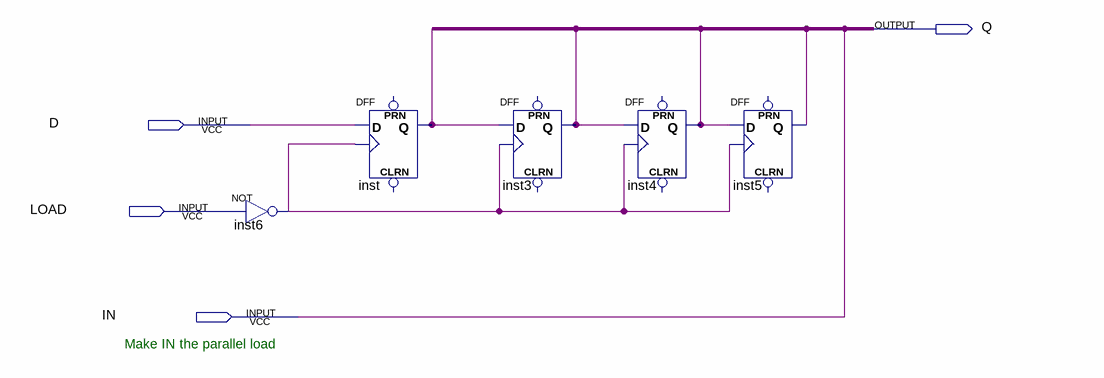
[diagram p0: schematic sheet]
// Quartus schematic BSR4.bdf as structural Verilog: 5 symbols, 4 pins
module BSR4 (
  input  D,
  input  LOAD,
  input  IN,
  output Q
);

  wire inst6_out;

  not inst6 (inst6_out, LOAD);
  DFF inst (.CLK(inst6_out), .D(D), .Q(Q));  // open: CLRN, PRN
  DFF inst3 (.CLK(inst6_out), .D(Q), .Q(Q));  // open: CLRN, PRN
  DFF inst4 (.CLK(inst6_out), .D(Q), .Q(Q));  // open: CLRN, PRN
  DFF inst5 (.CLK(inst6_out), .D(Q), .Q(Q));  // open: CLRN, PRN

  // Notes on the sheet:
  //   Make IN the parallel load
endmodule
